# EAGLE design aquapi2_fix (EAGLE 9.6.2)
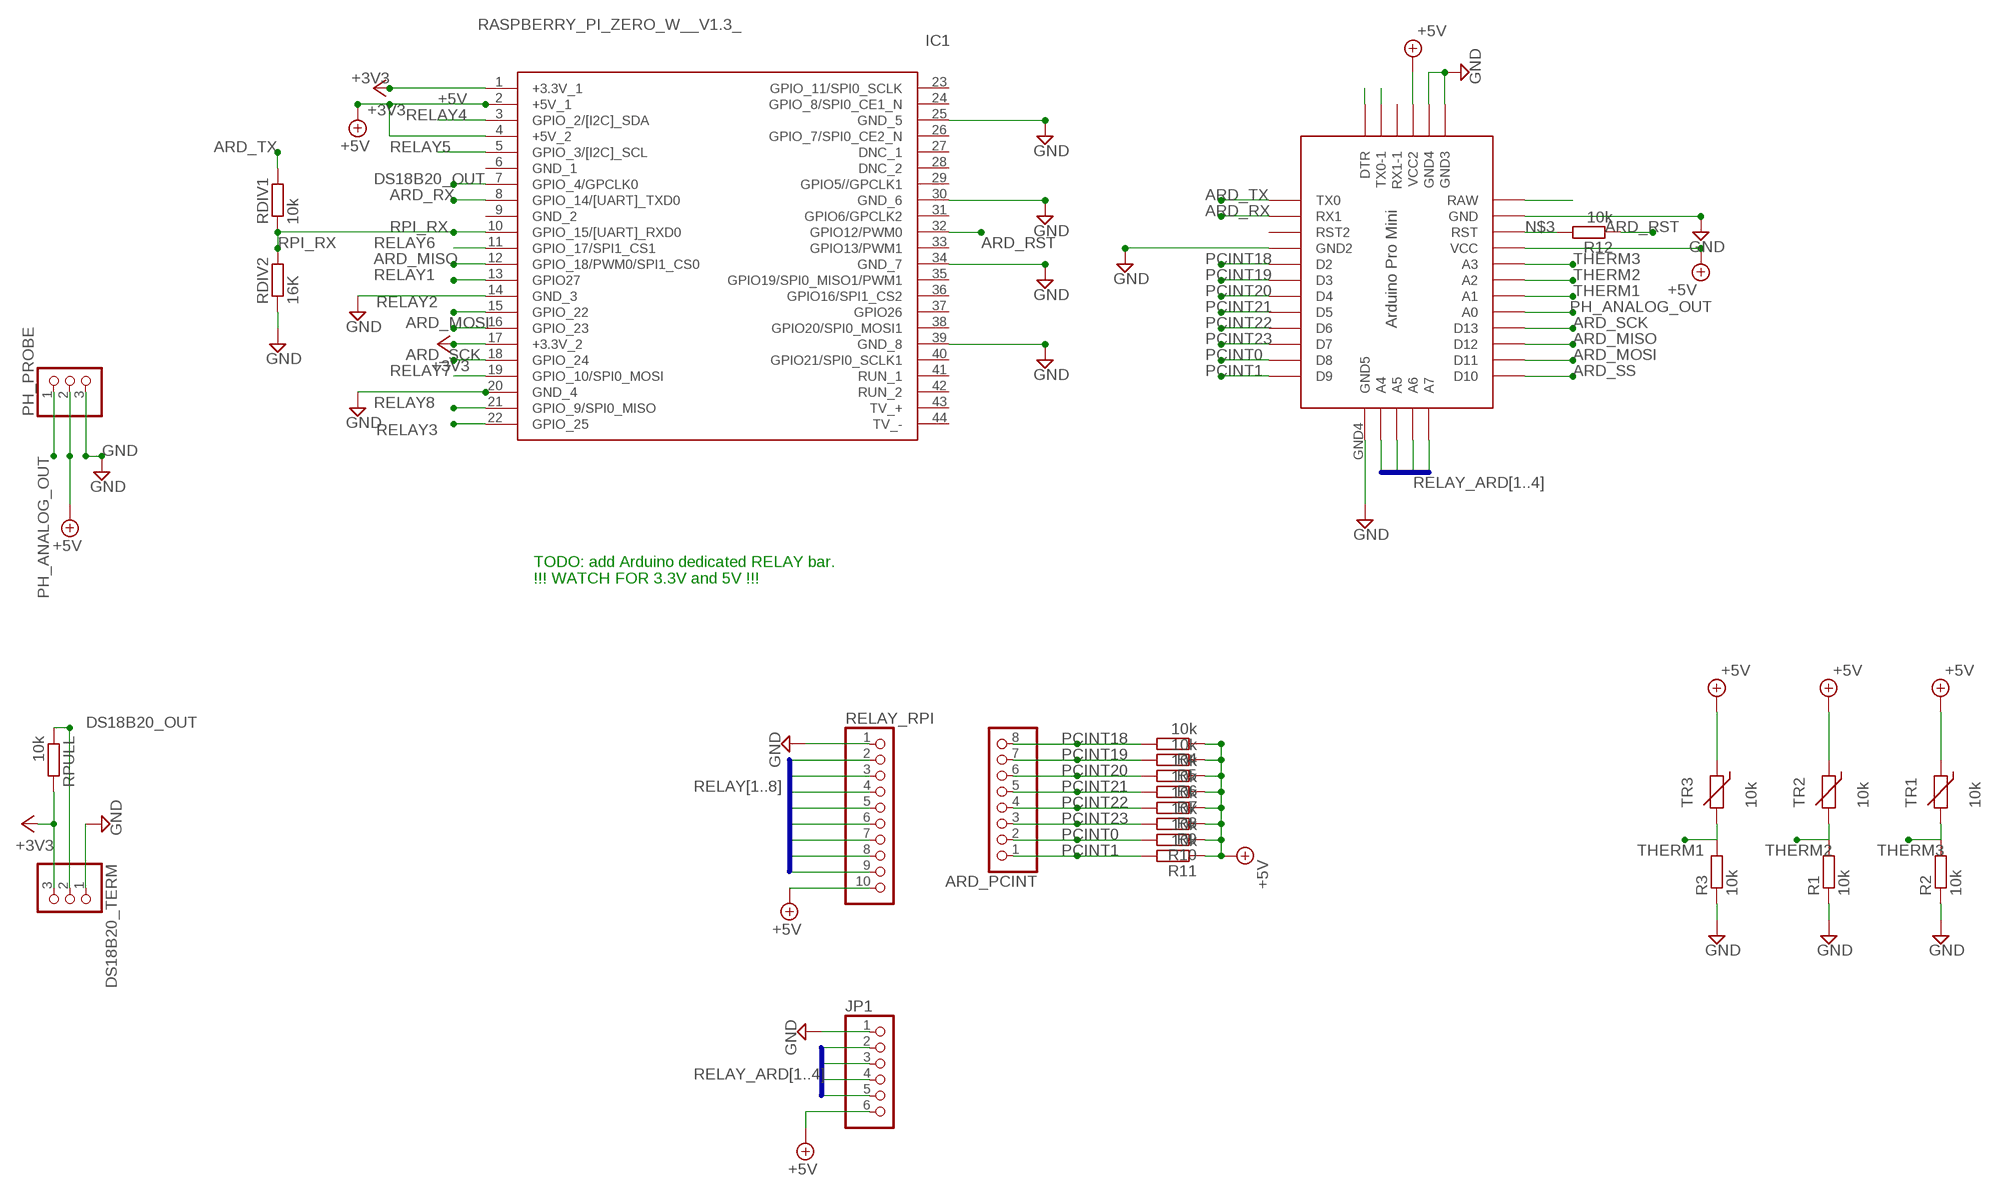
[diagram p0: schematic, sheet 1]

## Parts
ARD_PCINT  PINHD-1X8  [1X08]
DS18B20_TERM  PINHD-1X3  [1X03]
IC1  RASPBERRY_PI_ZERO_W__V1.3_  [RASPBERRYPIZEROWV13]
JP1  PINHD-1X6  [1X06]
PH_PROBE  PINHD-1X3  [1X03]
R1  10k  R-EU_R0805  [R0805]
R2  10k  R-EU_R0805  [R0805]
R3  10k  R-EU_R0805  [R0805]
R4  10k  R-EU_R0805  [R0805]
R5  10k  R-EU_R0805  [R0805]
R6  10k  R-EU_R0805  [R0805]
R7  10k  R-EU_R0805  [R0805]
R8  10k  R-EU_R0805  [R0805]
R9  10k  R-EU_R0805  [R0805]
R10  10k  R-EU_R0805  [R0805]
R11  10k  R-EU_R0805  [R0805]
R12  10k  R-EU_R0805  [R0805]
RDIV1  10k  R-EU_R0805  [R0805]
RDIV2  16K  R-EU_R0805  [R0805]
RELAY_RPI  PINHD-1X10  [1X10]
RPULL  10k  R-EU_R0805  [R0805]
TR1  10k  THERMISTOR_R-2,5  [RS-2,5]
TR2  10k  THERMISTOR_R-2,5  [RS-2,5]
TR3  10k  THERMISTOR_R-2,5  [RS-2,5]
U$2  PRO-MINI  [PRO-MINI]

## Nets
+3V3: DS18B20_TERM.3 IC1.1(+3.3V_1) IC1.17(+3.3V_2) RPULL.2
+5V: IC1.2(+5V_1) IC1.4(+5V_2) JP1.6 PH_PROBE.2 R4.1 R5.1 R6.1 R7.1 R8.1 R9.1 R10.1 R11.1 RELAY_RPI.10 TR1.1 TR2.1 TR3.1 U$2.VCC U$2.VCC1(VCC2)
ARD_MISO: IC1.12(GPIO_18/PWM0/SPI1_CS0) U$2.D12
ARD_MOSI: IC1.16(GPIO_23) U$2.D11
ARD_RST: IC1.32(GPIO12/PWM0) R12.1
ARD_RX: IC1.8(GPIO_14/[UART]_TXD0) U$2.RX1
ARD_SCK: IC1.18(GPIO_24) U$2.D13
ARD_SS: U$2.D10
ARD_TX: RDIV1.2 U$2.TX0
DS18B20_OUT: DS18B20_TERM.2 IC1.7(GPIO_4/GPCLK0) RPULL.1
GND: DS18B20_TERM.1 IC1.14(GND_3) IC1.20(GND_4) IC1.25(GND_5) IC1.30(GND_6) IC1.34(GND_7) IC1.39(GND_8) JP1.1 PH_PROBE.3 R1.1 R2.1 R3.1 RDIV2.1 RELAY_RPI.1 U$2.GND1(GND2) U$2.GND2(GND4) U$2.GND3 U$2.GND4(GND5)
N$3: R12.2 U$2.RST
N$4: U$2.RAW
N$10: U$2.TX0-1
N$13: U$2.GND ; supply symbol labelled GND
N$15: U$2.DTR
PCINT0: ARD_PCINT.2 R10.2 U$2.D8
PCINT1: ARD_PCINT.1 R11.2 U$2.D9
PCINT18: ARD_PCINT.8 R4.2 U$2.D2
PCINT19: ARD_PCINT.7 R5.2 U$2.D3
PCINT20: ARD_PCINT.6 R6.2 U$2.D4
PCINT21: ARD_PCINT.5 R7.2 U$2.D5
PCINT22: ARD_PCINT.4 R8.2 U$2.D6
PCINT23: ARD_PCINT.3 R9.2 U$2.D7
PH_ANALOG_OUT: PH_PROBE.1 U$2.A0
RELAY1: IC1.13(GPIO27) RELAY_RPI.2
RELAY2: IC1.15(GPIO_22) RELAY_RPI.3
RELAY3: IC1.22(GPIO_25) RELAY_RPI.4
RELAY4: IC1.3(GPIO_2/[I2C]_SDA) RELAY_RPI.5
RELAY5: IC1.5(GPIO_3/[I2C]_SCL) RELAY_RPI.6
RELAY6: IC1.11(GPIO_17/SPI1_CS1) RELAY_RPI.7
RELAY7: IC1.19(GPIO_10/SPI0_MOSI) RELAY_RPI.8
RELAY8: IC1.21(GPIO_9/SPI0_MISO) RELAY_RPI.9
RELAY_ARD1: JP1.2 U$2.A4
RELAY_ARD2: JP1.3 U$2.A5
RELAY_ARD3: JP1.4 U$2.A6
RELAY_ARD4: JP1.5 U$2.A7
RPI_RX: IC1.10(GPIO_15/[UART]_RXD0) RDIV1.1 RDIV2.2
THERM1: R3.2 TR3.2 U$2.A1
THERM2: R1.2 TR2.2 U$2.A2
THERM3: R2.2 TR1.2 U$2.A3
Unconnected: IC1.6(GND_1) IC1.9(GND_2) IC1.23(GPIO_11/SPI0_SCLK) IC1.24(GPIO_8/SPI0_CE1_N) IC1.26(GPIO_7/SPI0_CE2_N) IC1.27(DNC_1) IC1.28(DNC_2) IC1.29(GPIO5//GPCLK1) IC1.31(GPIO6/GPCLK2) IC1.33(GPIO13/PWM1) IC1.35(GPIO19/SPI0_MISO1/PWM1) IC1.36(GPIO16/SPI1_CS2) IC1.37(GPIO26) IC1.38(GPIO20/SPI0_MOSI1) IC1.40(GPIO21/SPI0_SCLK1) IC1.41(RUN_1) IC1.42(RUN_2) IC1.43(TV_+) IC1.44(TV_-) U$2.RST1(RST2) U$2.RX1-1

## Buses
RELAY[1..8]
RELAY_ARD[1..4]

## Notes on the sheet
- TODO: add Arduino dedicated RELAY bar.
  !!! WATCH FOR 3.3V and 5V !!!

## Library data of the parts
ARD_PCINT = pinhead:PINHD-1X8: PIN HEADER
DS18B20_TERM PH_PROBE = pinhead:PINHD-1X3: PIN HEADER
IC1 = Raspberry_Pi_Zero_W__v1.3_:RASPBERRY_PI_ZERO_W__V1.3_: Raspberry Pi Zero W (v1.3) Single-board Computers Source: Datasheet <https://cdn.sparkfun.com/assets/learn_tutorials/6/7/6/PiZero_1.pdf>; DESCRIPTION: Raspberry Pi Zero W (v1.3) Single-board Computers; HEIGHT: mm; MANUFACTURER_NAME: RASPBERRY-PI; MANUFACTURER_PART_NUMBER: Raspberry Pi Zero W (v1.3)
JP1 = pinhead:PINHD-1X6: PIN HEADER
R1-R12 RDIV1 RDIV2 RPULL = rcl:R-EU_: RESISTOR, European symbol; SPICEPREFIX: R
RELAY_RPI = pinhead:PINHD-1X10: PIN HEADER
TR1-TR3 = discrete:THERMISTOR_: Thermo Resistor
U$2 = Arduino-clone:PRO-MINI: Arduion Pro Mini Clone V1.0 www.betemcu.cu

## Board
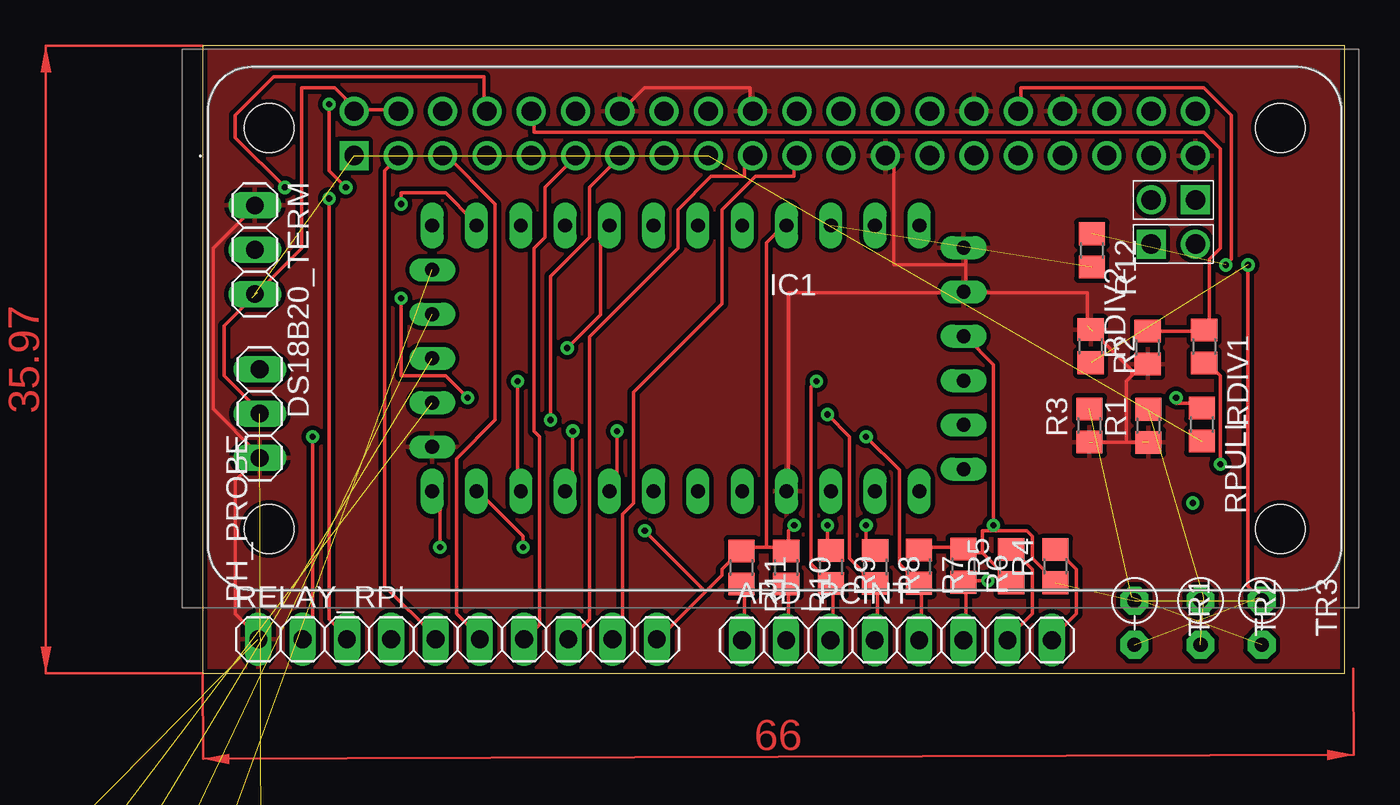
[diagram p1: board, top side]
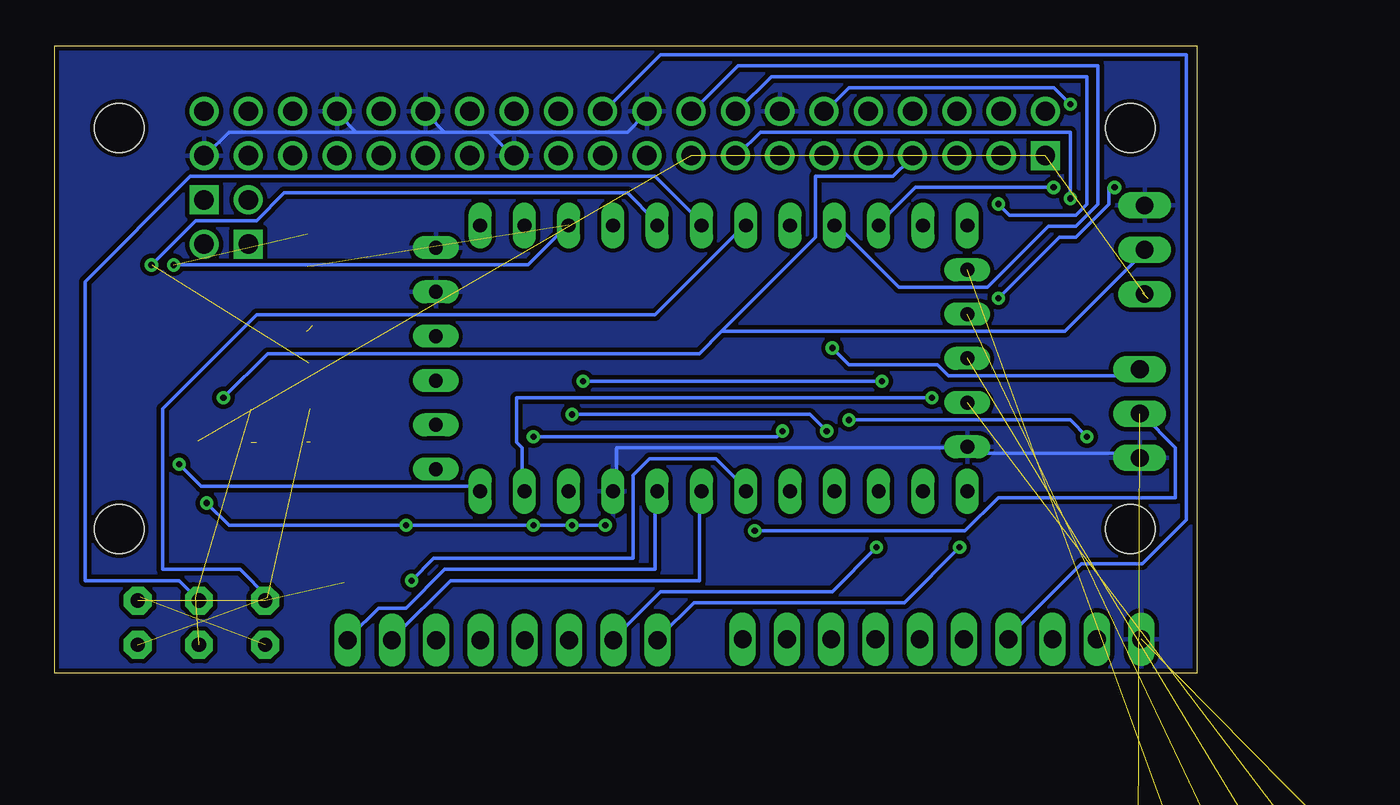
[diagram p2: board, bottom side, seen from below]

Size 65.5 x 35.97 mm. Coordinates in mm from the lower left corner, seen from the top.
Outline: 0,0 65.5,0 65.5,35.97 0,35.97 0,0
Copper layers (1*16): Top 0.035mm / dielectric 1.5mm / Bottom 0.035mm
Design rules "default *": minimum track width 8mil, minimum drill 0.35mm, track to track 8mil, track to pad 8mil, pad to pad 8mil, via to via 8mil, smd to smd 6mil, copper to edge 10mil, drill to drill 6mil, minimum pad ring 10mil, minimum via ring 8mil, stop-mask expansion 4mil, vias tented up to drill 0mil, thermal gap 10mil

### Footprints (pad centres in the part's own frame; a part is rotated, then mirrored left to right if it is on the bottom)
1X08 = drill 1.016 long: 1 -8.89,0; 2 -6.35,0; 3 -3.81,0; 4 -1.27,0; 5 1.27,0; 6 3.81,0; 7 6.35,0; 8 8.89,0
1X03 = drill 1.016 long: 1 -2.54,0; 2 0,0; 3 2.54,0
RASPBERRYPIZEROWV13 = drill 1.11 pad 1.665 square: 1 -23.885,9.92; 41 24.375,7.38; 43 21.835,4.84 | drill 1.11 pad 1.665: 2 -23.885,12.46; 3 -21.345,9.92; 4 -21.345,12.46; 5 -18.805,9.92; 6 -18.805,12.46; 7 -16.265,9.92; 8 -16.265,12.46; 9 -13.725,9.92; 10 -13.725,12.46; 11 -11.185,9.92; 12 -11.185,12.46; 13 -8.645,9.92; 14 -8.645,12.46; 15 -6.105,9.92; 16 -6.105,12.46; 17 -3.565,9.92; 18 -3.565,12.46; 19 -1.025,9.92; 20 -1.025,12.46; 21 1.515,9.92; 22 1.515,12.46; 23 4.055,9.92; 24 4.055,12.46; 25 6.595,9.92; 26 6.595,12.46; 27 9.135,9.92; 28 9.135,12.46; 29 11.675,9.92; 30 11.675,12.46; 31 14.215,9.92; 32 14.215,12.46; 33 16.755,9.92; 34 16.755,12.46; 35 19.295,9.92; 36 19.295,12.46; 37 21.835,9.92; 38 21.835,12.46; 39 24.375,9.92; 40 24.375,12.46; 42 21.835,7.38; 44 24.375,4.84 | hole 2.8: -28.755,11.5; -28.755,-11.5; 29.245,-11.5; 29.245,11.5
1X06 = drill 1.016 long: 1 -6.35,0; 2 -3.81,0; 3 -1.27,0; 4 1.27,0; 5 3.81,0; 6 6.35,0
R0805 = smd 1.3 x 1.5: 1 -0.95,0; 2 0.95,0
1X10 = drill 1.016 long: 1 -11.43,0; 2 -8.89,0; 3 -6.35,0; 4 -3.81,0; 5 -1.27,0; 6 1.27,0; 7 3.81,0; 8 6.35,0; 9 8.89,0; 10 11.43,0
RS-2,5 = drill 0.813 pad 1.6 octagon: 1 -1.27,0; 2 1.27,0
PRO-MINI = drill 0.8 long: A0 8.89,8.89; A1 8.89,11.43; A2 8.89,13.97; A3 8.89,16.51; A4 -1.27,-1.27; A5 1.27,-1.27; A6 3.81,-1.27; A7 6.35,-1.27; D2 -6.35,16.51; D3 -6.35,13.97; D4 -6.35,11.43; D5 -6.35,8.89; D6 -6.35,6.35; D7 -6.35,3.81; D8 -6.35,1.27; D9 -6.35,-1.27; D10 8.89,-1.27; D11 8.89,1.27; D12 8.89,3.81; D13 8.89,6.35; DTR -5.08,29.21; GND 8.89,24.13; GND1 -6.35,19.05; GND2 7.62,29.21; GND3 5.08,29.21; GND4 -3.81,-1.27; RAW 8.89,26.67; RST 8.89,21.59; RST1 -6.35,21.59; RX1 -6.35,24.13; RX1-1 0,29.21; TX0 -6.35,26.67; TX0-1 -2.54,29.21; VCC 8.89,19.05; VCC1 2.54,29.21

### Placement (x,y rotation side)
ARD_PCINT  39.82,1.89 0 top
DS18B20_TERM  2.98,24.28 270 top
IC1  32.57,19.76 0 top
JP1  -3,-10.76 0 top  (outside the outline)
PH_PROBE  3.27,14.88 270 top
R1  54.24,14.18 90 top
R2  50.93,18.75 270 top
R3  50.86,14.2 90 top
R4  48.91,6.13 90 top
R5  46.37,6.13 90 top
R6  43.63,6.16 270 top
R7  41.09,6.11 270 top
R8  38.57,6.08 270 top
R9  36.03,6.08 270 top
R10  33.47,6.05 270 top
R11  30.9,6.05 270 top
R12  51,24.24 270 top
RDIV1  57.44,18.73 270 top
RDIV2  54.2,18.67 90 top
RELAY_RPI  14.62,1.94 0 top
RPULL  57.31,14.26 270 top
TR1  53.44,2.89 270 top
TR2  57.23,2.89 270 top
TR3  60.74,2.89 270 top
U$2  14.44,16.78 90 bottom

### Tracks (layer width: path | path; a pad name or v marks a point on that pad's centre or on a via)
+3V3  (3 unrouted)
+5V  (via drill 0.35)  (5 unrouted)
  Top 0.203: IC1.4 11.06,32.29 8.84,32.29 IC1.2 8.53,32.29 8.21,32.61 8.21,32.93 7.57,33.56 5.67,33.56 5.67,24.35 3.13,21.82 | 2.81,21.5 1.22,19.91 1.22,17.05 3.13,15.15 PH_PROBE.2 | R7.1 41.23,7.21 43.45,7.21 R6.1 43.77,6.89 44.72,6.89 | 44.72,6.89 46.31,5.31 R5.1 | 45.35,8.16 44.72,8.16 44.72,6.89 | 45.35,8.16 47.26,8.16 47.58,7.85 47.58,6.58 48.85,5.31 R4.1 | 45.35,8.16 v45.35,8.48 45.35,17.69 43.77,19.28 U$2.VCC1 | 32.34,7.21 33.29,7.21 R10.1 33.61,7.21 33.61,8.16 v33.92,8.48 | 32.34,7.21 31.07,7.21 R11.1 30.75,6.89 29.8,5.94 29.8,5.62 28.84,4.67 | v35.83,8.48 35.83,7.21 R9.1 | v38.05,8.48 38.05,7.53 38.37,7.21 R8.1 | 32.34,7.21 32.34,24.67 33.29,25.63 U$2.VCC | 28.84,4.67 26.3,2.13 RELAY_RPI.10 | 28.84,4.67 v25.35,8.16
  Bottom 0.203: v33.92,8.48 v35.83,8.48 v38.05,8.48 v45.35,8.48 55.52,8.48 v56.78,9.75 | v25.35,8.16 13.29,8.16 11.38,10.07 1.22,10.07 1.22,12.93 3.13,14.83 PH_PROBE.2
ARD_MISO  (via drill 0.35)
  Top 0.203: v8.21,27.85 7.26,28.8 v7.26,32.61
  Bottom 0.203: v8.21,27.85 16.14,27.85 18.05,25.94 U$2.D12 | v7.26,32.61 8.21,33.56 19.95,33.56 21.23,32.29 IC1.12
ARD_MOSI  (via drill 0.35)
  Top 0.203: v11.38,26.89 11.38,27.53 13.92,27.53 15.51,25.94 U$2.D11
  Bottom 0.203: v11.38,26.89 10.75,26.26 6.94,26.26 6.3,26.89 6.3,34.2 24.4,34.2 26.3,32.29 IC1.16
ARD_RST  (via drill 0.35)  (1 unrouted)
  Top 0.203: v58.69,23.4 59.01,23.72 59.01,31.98 57.42,33.56 46.94,33.56 46.94,32.29 IC1.32
  Bottom 0.203: 36.15,25.63 38.37,23.4 v58.69,23.4
ARD_RX  (via drill 0.35)
  Top 0.203: v15.19,15.78 13.92,17.05 11.38,17.05 v11.38,21.5 | v4.71,27.85 1.86,30.71 1.86,31.98 4.08,34.2 16.14,34.2 16.14,32.29 IC1.8
  Bottom 0.203: v15.19,15.78 39.01,15.78 39.01,13.24 38.69,12.93 38.69,10.7 U$2.RX1 | v11.38,21.5 7.89,24.99 6.94,24.99 5.03,26.89 5.03,27.85 v4.71,27.85
ARD_SCK
  Bottom 0.203: U$2.D13 20.59,25.63 17.1,22.13 12.02,22.13 8.53,25.63 6.94,25.63 5.67,26.89 5.67,34.83 26.3,34.83 28.84,32.29 IC1.18
ARD_TX  (via drill 0.35)
  Top 0.203: v58.37,11.97 58.37,17.05 57.74,17.69 RDIV1.2
  Bottom 0.203: v58.37,11.97 57.1,10.7 41.23,10.7 U$2.TX0
DS18B20_OUT  (via drill 0.35)
  Top 0.203: v55.83,15.78 55.83,15.46 57.1,15.46 RPULL.1
  Bottom 0.203: v55.83,15.78 53.29,18.32 28.53,18.32 27.26,19.59 | 27.26,19.59 21.86,24.99 21.86,28.48 17.41,28.48 16.46,29.44 IC1.7 | 27.26,19.59 7.57,19.59 3.13,24.04 DS18B20_TERM.2
GND  (5 unrouted)
  Top 0.203: 43.77,23.4 43.77,24.35 U$2.GND2 | 43.77,23.4 43.77,22.13 U$2.GND3 | 53.93,13.24 52.98,13.24 | 52.98,13.24 51.07,13.24 | 53.29,17.05 52.98,16.74 52.98,13.24 | 53.29,17.05 53.93,17.69 RDIV2.1 | 51.07,19.59 53.29,17.37 53.29,17.05 | 50.75,19.91 50.75,21.82 43.77,21.82 U$2.GND3 | IC1.14 24.08,32.29 25.35,33.56 31.38,33.56 31.38,32.29 IC1.20 | 43.77,23.4 39.64,23.4 39.64,29.12 39.32,29.44 IC1.25 | RELAY_RPI.1 3.13,2.13 1.86,3.4 1.86,11.02 3.13,12.29 PH_PROBE.3 3.13,12.61 0.59,15.15 0.59,24.35 2.81,26.58 DS18B20_TERM.1 | U$2.GND3 43.45,21.82 33.61,21.82 33.61,10.7 U$2.GND1
  Bottom 0.203: 40.59,31.02 39.32,29.75 IC1.25 | 43.13,31.02 40.59,31.02 | 43.13,31.02 44.09,31.98 IC1.30 | 48.21,31.02 49.16,31.98 IC1.34 | 43.13,31.02 48.21,31.02 | 48.21,31.02 55.52,31.02 56.78,29.75 IC1.39 | 40.59,31.02 32.66,31.02 31.7,31.98 IC1.20 | U$2.GND1 33.29,10.7 33.29,12.93 13.29,12.93 U$2.GND4 12.97,12.93 12.65,12.61 3.45,12.61 PH_PROBE.3
  pour Top (isolate 0.254): 0.27,36.1 65.67,36.1 65.67,-0.09 0.27,-0.09
  pour Bottom (isolate 0.254): 0.27,36.1 65.67,36.1 65.67,-0.09 0.27,-0.09
N$3  (1 unrouted)
PCINT0  (via drill 0.35)
  Top 0.203: R10.2 33.61,4.99 33.61,2.13 ARD_PCINT.2 | v18.37,7.21 18.37,7.85 15.83,10.39 U$2.D8
  Bottom 0.203: v18.37,7.21 20.91,4.67 30.75,4.67 33.29,2.13 ARD_PCINT.2
PCINT1  (via drill 0.35)
  Top 0.203: R11.2 31.07,4.99 31.07,2.13 ARD_PCINT.1 | v13.61,7.21 13.61,10.07 13.29,10.39 U$2.D9
  Bottom 0.203: v13.61,7.21 16.78,4.04 28.84,4.04 30.75,2.13 ARD_PCINT.1
PCINT18
  Top 0.203: R4.2 49.16,6.89 50.12,5.94 50.12,3.4 48.85,2.13 ARD_PCINT.8
  Bottom 0.203: U$2.D2 31.07,10.39 31.07,5.94 43.13,5.94 45.35,3.72 46.94,3.72 48.53,2.13 ARD_PCINT.8
PCINT19
  Top 0.203: R5.2 46.62,6.89 47.58,5.94 47.58,3.4 46.31,2.13 ARD_PCINT.7
  Bottom 0.203: U$2.D3 28.53,10.39 28.53,5.31 42.81,5.31 45.99,2.13 ARD_PCINT.7
PCINT20  (via drill 0.35)
  Top 0.203: ARD_PCINT.6 43.77,2.13 43.77,4.99 R6.2 43.77,5.31 v45.04,5.31
  Bottom 0.203: v45.04,5.31 43.77,6.58 32.34,6.58 32.34,11.34 31.38,12.29 27.57,12.29 25.99,10.7 U$2.D4
PCINT21  (via drill 0.35)
  Top 0.203: ARD_PCINT.5 41.23,2.13 41.23,4.99 R7.2 40.91,5.31 39.96,6.26 39.96,11.66 v38.05,13.56 | v23.77,13.88 23.77,11.02 23.45,10.7 U$2.D5
  Bottom 0.203: v23.77,13.88 24.08,13.56 v38.05,13.56
PCINT22  (via drill 0.35)
  Top 0.203: ARD_PCINT.4 38.69,2.13 38.69,4.99 R8.2 38.37,5.31 37.1,6.58 37.1,13.56 v35.83,14.83 | v21.23,13.88 21.23,11.02 20.91,10.7 U$2.D6
  Bottom 0.203: v21.23,13.88 22.18,14.83 v35.83,14.83
PCINT23  (via drill 0.35)
  Top 0.203: ARD_PCINT.3 36.15,2.13 36.15,4.99 R9.2 35.83,5.31 34.88,6.26 34.88,16.42 v35.2,16.74 | v18.05,16.74 18.05,10.7 U$2.D7
  Bottom 0.203: v35.2,16.74 v18.05,16.74
PH_ANALOG_OUT  (via drill 0.35)
  Top 0.203: v20.91,18.64 22.81,20.55 22.81,25.31 23.13,25.63 U$2.A0
  Bottom 0.203: v20.91,18.64 19.95,17.69 14.88,17.69 14.24,17.05 3.76,17.05 3.45,17.37 PH_PROBE.1
RELAY1  (via drill 0.35)
  Top 0.203: v6.3,13.56 6.3,2.45 5.99,2.13 RELAY_RPI.2 | v19.95,14.51 19.95,22.77 22.18,24.99 22.18,27.85 23.77,29.44 IC1.13
  Bottom 0.203: v6.3,13.56 7.26,14.51 v19.95,14.51
RELAY2  (via drill 0.35)
  Top 0.203: v7.26,27.21 7.26,3.08 8.21,2.13 RELAY_RPI.3
  Bottom 0.203: v7.26,27.21 7.26,31.02 25.04,31.02 26.3,29.75 IC1.15
RELAY3
  Bottom 0.203: RELAY_RPI.4 10.75,2.13 6.62,6.26 3.13,6.26 0.59,8.8 0.59,35.47 30.75,35.47 33.92,32.29 IC1.22
RELAY4
  Top 0.203: RELAY_RPI.5 13.29,2.13 10.43,4.99 10.43,28.8 11.06,29.44 IC1.3
RELAY5
  Top 0.203: RELAY_RPI.6 15.83,2.13 14.56,3.4 14.56,12.29 16.78,14.51 16.78,26.89 13.92,29.75 IC1.5
RELAY6
  Top 0.203: RELAY_RPI.7 18.68,2.13 19.32,2.77 19.32,13.56 19,13.88 19,24.35 19.64,24.99 19.64,27.85 21.23,29.44 IC1.11
RELAY7
  Top 0.203: RELAY_RPI.8 21.23,2.13 22.18,3.08 22.18,19.28 27.26,24.35 27.26,26.58 29.16,28.48 31.07,28.48 31.07,29.12 31.38,29.44 IC1.19
RELAY8
  Top 0.203: RELAY_RPI.9 23.77,2.13 24.08,2.45 24.08,9.12 24.72,9.75 24.72,16.1 29.8,21.18 29.8,26.58 31.7,28.48 33.92,28.48 33.92,29.44 IC1.21
RELAY_ARD1  (1 unrouted)
RELAY_ARD2  (1 unrouted)
RELAY_ARD3  (1 unrouted)
RELAY_ARD4  (1 unrouted)
RPI_RX
  Top 0.203: RDIV2.2 54.24,19.59 57.42,19.59 RDIV1.1 57.74,19.91 57.74,23.72 58.37,24.35 58.37,30.07 57.42,31.02 19,31.02 19,31.98 IC1.10
THERM1  (2 unrouted)
  Bottom 0.203: 53.29,4.35 54.88,5.94 59.33,5.94 59.33,15.15 53.93,20.55 31.07,20.55 25.99,25.63 U$2.A1
THERM2  (2 unrouted)
  Bottom 0.203: 57.42,4.35 58.37,5.31 63.77,5.31 63.77,22.45 57.74,28.48 31.07,28.48 28.53,25.94 U$2.A2
THERM3  (via drill 0.35)  (2 unrouted)
  Top 0.203: v59.96,23.4 59.96,4.99 60.59,4.35
  Bottom 0.203: v59.96,23.4 57.42,25.94 53.93,25.94 52.34,27.53 32.66,27.53 31.07,25.94 U$2.A3
(copper drawn outside any net)
  shapes: Top area x2